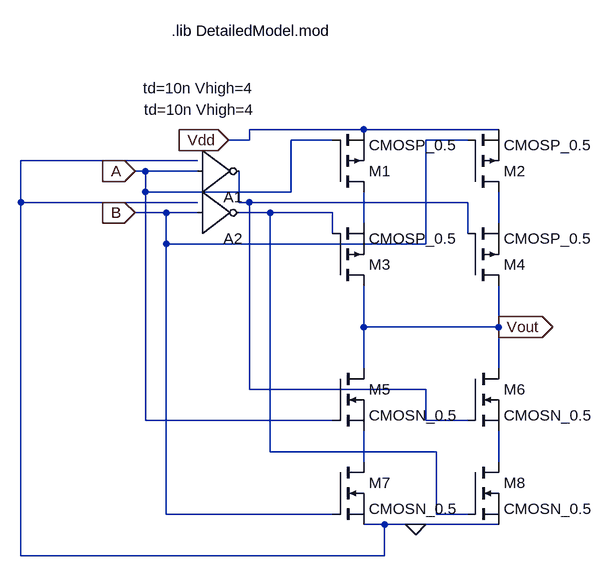
[diagram p0: schematic xor.asc]
xor.asc, the LTspice schematic file:
Version 4
SHEET 1 880 680
WIRE 288 -32 112 -32
WIRE 496 -32 288 -32
WIRE 112 -16 112 -32
WIRE 112 -16 80 -16
WIRE 240 -16 176 -16
WIRE 448 -16 384 -16
WIRE 32 16 -240 16
WIRE -48 32 -64 32
WIRE 32 32 -48 32
WIRE -48 64 -48 32
WIRE 176 64 176 -16
WIRE 176 64 -48 64
WIRE -240 80 -240 16
WIRE 32 80 -240 80
WIRE 96 80 96 32
WIRE 112 80 96 80
WIRE 448 80 112 80
WIRE -16 96 -64 96
WIRE 32 96 -16 96
WIRE 144 96 96 96
WIRE 240 96 144 96
WIRE 288 112 288 64
WIRE 496 112 496 64
WIRE 240 128 240 96
WIRE 448 128 448 80
WIRE -16 144 -16 96
WIRE 384 144 384 -16
WIRE 384 144 -16 144
WIRE 288 272 288 208
WIRE 496 272 496 208
WIRE 496 272 288 272
WIRE 288 336 288 272
WIRE 496 336 496 272
WIRE 112 368 112 80
WIRE 384 368 112 368
WIRE -48 416 -48 64
WIRE 240 416 -48 416
WIRE 384 416 384 368
WIRE 448 416 384 416
WIRE 144 464 144 96
WIRE 400 464 144 464
WIRE 288 480 288 432
WIRE 496 480 496 432
WIRE -16 560 -16 144
WIRE 240 560 -16 560
WIRE 400 560 400 464
WIRE 448 560 400 560
WIRE 320 576 288 576
WIRE 368 576 320 576
WIRE 496 576 368 576
WIRE -240 624 -240 80
WIRE 320 624 320 576
WIRE 320 624 -240 624
FLAG 80 -16 Vdd
IOPIN 80 -16 In
FLAG -64 32 A
IOPIN -64 32 In
FLAG -64 96 B
IOPIN -64 96 In
FLAG 368 576 0
FLAG 496 272 Vout
IOPIN 496 272 Out
SYMBOL Digital\\inv 32 96 M180
WINDOW 3 -84 192 Left 2
SYMATTR InstName A1
SYMATTR Value td=10n Vhigh=4
SYMBOL Digital\\inv 32 160 M180
WINDOW 3 -82 223 Left 2
SYMATTR InstName A2
SYMATTR Value td=10n Vhigh=4
SYMBOL pmos 240 64 M180
SYMATTR InstName M1
SYMATTR Value CMOSP_0.5
SYMBOL pmos 448 64 M180
SYMATTR InstName M2
SYMATTR Value CMOSP_0.5
SYMBOL pmos 240 208 M180
SYMATTR InstName M3
SYMATTR Value CMOSP_0.5
SYMBOL pmos 448 208 M180
SYMATTR InstName M4
SYMATTR Value CMOSP_0.5
SYMBOL nmos 240 336 R0
SYMATTR InstName M5
SYMATTR Value CMOSN_0.5
SYMBOL nmos 448 336 R0
SYMATTR InstName M6
SYMATTR Value CMOSN_0.5
SYMBOL nmos 240 480 R0
SYMATTR InstName M7
SYMATTR Value CMOSN_0.5
SYMBOL nmos 448 480 R0
SYMATTR InstName M8
SYMATTR Value CMOSN_0.5
TEXT -8 -184 Left 2 !.lib DetailedModel.mod

The netlist it stands for:
* xor.asc
A1 A 0 0 0 0 N001 0 0 BUF td=10n Vhigh=4
A2 B 0 0 0 0 N002 0 0 BUF td=10n Vhigh=4
M1 N003 A Vdd Vdd CMOSP_0.5
M2 N004 B Vdd Vdd CMOSP_0.5
M3 Vout N002 N003 N003 CMOSP_0.5
M4 Vout N001 N004 N004 CMOSP_0.5
M5 Vout A N005 N005 CMOSN_0.5
M6 Vout N001 N006 N006 CMOSN_0.5
M7 N005 B 0 0 CMOSN_0.5
M8 N006 N002 0 0 CMOSN_0.5
.model NMOS NMOS
.model PMOS PMOS
.lib standard.mos
.lib DetailedModel.mod
.backanno
.end